# Altium project HPBIController.PrjPCB (part 8 of 8)
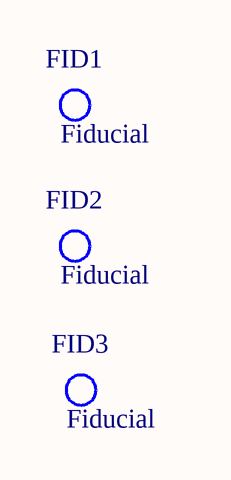
[diagram p115: BlockDiagram.SchDoc]

## Nets that join several sheets
1.0V: FPGAPower (46 pins), Power (6 pins)
1.2V: Ethernet (14 pins), Power (C244.1 C245.1 TP7.1 U6.4)
1.5V: DDR3A (37 pins), DDR3B (37 pins), FPGAPower (20 pins), Power (8 pins)
1.8V: DDR3B (C43.1 U4.2), FPGAPower (22 pins), HeaderC (J5.181 J5.182 J5.183 J5.184), Power (6 pins)
1.8VADC: Bank0-13-33 (R117.2), FPGAPower (C74.1 C75.1 L4.1 U1.K11)
3.3V: ADC (6 pins), Bank0-13-33 (9 pins), DDR3B (C41.1 R33.1 R34.1 U4.10), Ethernet (22 pins), FPGAPower (19 pins), HeaderA (J3.151 J3.153 J3.155), IOPower (6 pins), QSPIFlash (30 pins), Power (10 pins)
4.096VREF: DAC (C235.1 TP17.1 U22.10 U23.5), HeaderA (J3.112)
5V: DAC (8 pins), HeaderA (C247.1 C248.1 U24.8), HeaderC (J5.189 J5.190 J5.191 J5.192), IOPower (8 pins), Power (6 pins)
12VIN_HDR: HeaderA (J3.181 J3.182 J3.183 J3.184), HeaderB (J4.181 J4.182 J4.183 J4.184), Power (D3.1)
GND: ADC (28 pins), Bank0-13-33 (13 pins), DAC (17 pins), DDR3A (44 pins), DDR3B (57 pins), Ethernet (36 pins), FPGAPower (166 pins), HeaderA (114 pins), HeaderB (88 pins), HeaderC (84 pins), IOPower (20 pins), QSPIFlash (29 pins), Power (64 pins)
VCCO_13: FPGAPower (16 pins), HeaderA (J3.122 J3.124 J3.126), IOPower (6 pins)
VCCO_33: FPGAPower (15 pins), HeaderA (J3.128 J3.130 J3.132), IOPower (6 pins)
VCCO_34: FPGAPower (15 pins), HeaderA (J3.134 J3.136 J3.138), IOPower (6 pins)
VCCO_35: FPGAPower (16 pins), HeaderA (J3.140 J3.142 J3.144), IOPower (6 pins)
VTTREF: DDR3A (7 pins), DDR3B (5 pins)
AD00_N: Bank34-35 (U1.E16), HeaderA (J3.102)
AD00_P: Bank34-35 (U1.F16), HeaderA (J3.100)
AD01_N: Bank34-35 (U1.D15), HeaderA (J3.96)
AD01_P: Bank34-35 (U1.E15), HeaderA (J3.94)
AD02_N: Bank34-35 (U1.B15), HeaderA (J3.90)
AD02_P: Bank34-35 (U1.C15), HeaderA (J3.88)
AD03_N: Bank34-35 (U1.A17), HeaderA (J3.72)
AD03_P: Bank34-35 (U1.A16), HeaderA (J3.70)
AD04_N: Bank34-35 (U1.C20), HeaderA (J3.36)
AD04_P: Bank34-35 (U1.D20), HeaderA (J3.34)
AD05_N: Bank34-35 (U1.D21), HeaderA (J3.30)
AD05_P: Bank34-35 (U1.E21), HeaderA (J3.28)
AD06_N: Bank34-35 (U1.F19), HeaderA (J3.12)
AD06_P: Bank34-35 (U1.G19), HeaderA (J3.10)
AD07_N: Bank34-35 (U1.G21), HeaderA (J3.18)
AD07_P: Bank34-35 (U1.G20), HeaderA (J3.16)
AD08_N: Bank34-35 (U1.D17), HeaderA (J3.84)
AD08_P: Bank34-35 (U1.D16), HeaderA (J3.82)
AD09_N: Bank34-35 (U1.E18), HeaderA (J3.48)
AD09_P: Bank34-35 (U1.F18), HeaderA (J3.46)
AD10_N: Bank34-35 (U1.B17), HeaderA (J3.78)
AD10_P: Bank34-35 (U1.B16), HeaderA (J3.76)
AD11_N: Bank34-35 (U1.A19), HeaderA (J3.66)
AD11_P: Bank34-35 (U1.A18), HeaderA (J3.64)
AD12_N: Bank34-35 (U1.A22), HeaderA (J3.54)
AD12_P: Bank34-35 (U1.A21), HeaderA (J3.52)
AD13_N: Bank34-35 (U1.B22), HeaderA (J3.42)
AD13_P: Bank34-35 (U1.B21), HeaderA (J3.40)
AD14_N: Bank34-35 (U1.E20), HeaderA (J3.24)
AD14_P: Bank34-35 (U1.E19), HeaderA (J3.22)
AD15_N: Bank34-35 (U1.G22), HeaderA (J3.6)
AD15_P: Bank34-35 (U1.H22), HeaderA (J3.4)
AD16_N: Bank0-13-33 (U1.M12), HeaderA (NT1.1)
AD16_P: Bank0-13-33 (U1.L11), HeaderA (R122.2 R130.1)
ADC_EOC: ADC (U21.25), HeaderC (J5.39), QSPIFlash (JP1.1)
ADC_IN0: ADC (R83.1), HeaderA (J3.63)
ADC_IN1: ADC (R84.1), HeaderA (J3.67)
ADC_IN2: ADC (R85.1), HeaderA (J3.71)
ADC_IN3: ADC (R86.1), HeaderA (J3.75)
ADC_IN4: ADC (R88.1), HeaderA (J3.79)
ADC_IN5: ADC (R90.1), HeaderA (J3.83)
ADC_IN6: ADC (R92.1), HeaderA (J3.87)
ADC_IN7: ADC (R87.1), HeaderA (J3.91)
ADC_IN8: ADC (R89.1), HeaderA (J3.95)
ADC_IN9: ADC (R91.1), HeaderA (J3.99)
ADC_IN10: ADC (R93.1), HeaderA (J3.103)
ADC_IN11: ADC (R94.1), HeaderA (J3.107)
ADC_IN12: ADC (R95.1), HeaderA (J3.111)
ADC_IN13: ADC (R96.1), HeaderA (J3.115)
ADC_IN14: ADC (R97.1), HeaderA (J3.53)
ADC_IN15: ADC (R98.1), HeaderA (J3.57)
BANK13_IO_00: Bank0-13-33 (U1.R7), HeaderB (J4.18)
BANK13_IO_25: Bank0-13-33 (U1.U7), HeaderB (J4.40)
BANK13_LVDS01_N: Bank0-13-33 (U1.V9), HeaderB (J4.76)
BANK13_LVDS01_P: Bank0-13-33 (U1.V10), HeaderB (J4.74)
BANK13_LVDS02_N: Bank0-13-33 (U1.W8), HeaderB (J4.37)
BANK13_LVDS02_P: Bank0-13-33 (U1.V8), HeaderB (J4.39)
BANK13_LVDS03_N: Bank0-13-33 (U1.W10), HeaderB (J4.110)
BANK13_LVDS03_P: Bank0-13-33 (U1.W11), HeaderB (J4.112)
BANK13_LVDS04_N: Bank0-13-33 (U1.W12), HeaderB (J4.51)
BANK13_LVDS04_P: Bank0-13-33 (U1.V12), HeaderB (J4.49)
BANK13_LVDS05_N: Bank0-13-33 (U1.U11), HeaderB (J4.116)
BANK13_LVDS05_P: Bank0-13-33 (U1.U12), HeaderB (J4.118)
BANK13_LVDS06_N: Bank0-13-33 (U1.U9), HeaderB (J4.70)
BANK13_LVDS06_P: Bank0-13-33 (U1.U10), HeaderB (J4.68)
BANK13_LVDS07_N: Bank0-13-33 (U1.AB12), HeaderB (J4.109)
BANK13_LVDS07_P: Bank0-13-33 (U1.AA12), HeaderB (J4.111)
BANK13_LVDS08_N: Bank0-13-33 (U1.AB11), HeaderB (J4.104)
BANK13_LVDS08_P: Bank0-13-33 (U1.AA11), HeaderB (J4.106)
BANK13_LVDS09_N: Bank0-13-33 (U1.AB9), HeaderB (J4.103)
BANK13_LVDS09_P: Bank0-13-33 (U1.AB10), HeaderB (J4.105)
BANK13_LVDS10_N: Bank0-13-33 (U1.Y10), HeaderB (J4.92)
BANK13_LVDS10_P: Bank0-13-33 (U1.Y11), HeaderB (J4.94)
BANK13_LVDS11_N: Bank0-13-33 (U1.AA8), HeaderB (J4.98)
BANK13_LVDS11_P: Bank0-13-33 (U1.AA9), HeaderB (J4.100)
BANK13_LVDS12/SYSCLK1_N: Bank0-13-33 (U1.Y8), HeaderB (J4.31)
BANK13_LVDS12/SYSCLK1_P: Bank0-13-33 (U1.Y9), HeaderB (J4.33)
BANK13_LVDS13_N: Bank0-13-33 (U1.Y5), HeaderB (J4.86)
BANK13_LVDS13_P: Bank0-13-33 (U1.Y6), HeaderB (J4.88)
BANK13_LVDS14_N: Bank0-13-33 (U1.AA6), HeaderB (J4.25)
BANK13_LVDS14_P: Bank0-13-33 (U1.AA7), HeaderB (J4.27)
BANK13_LVDS15_N: Bank0-13-33 (U1.AB1), HeaderB (J4.85)
BANK13_LVDS15_P: Bank0-13-33 (U1.AB2), HeaderB (J4.87)
BANK13_LVDS16_N: Bank0-13-33 (U1.AB4), HeaderB (J4.91)
BANK13_LVDS16_P: Bank0-13-33 (U1.AB5), HeaderB (J4.93)
BANK13_LVDS17_N: Bank0-13-33 (U1.AB6), HeaderB (J4.97)
BANK13_LVDS17_P: Bank0-13-33 (U1.AB7), HeaderB (J4.99)
BANK13_LVDS18_N: Bank0-13-33 (U1.AA4), HeaderB (J4.52)
BANK13_LVDS18_P: Bank0-13-33 (U1.Y4), HeaderB (J4.50)
BANK13_LVDS19_N: Bank0-13-33 (U1.T6), HeaderB (J4.24)
BANK13_LVDS19_P: Bank0-13-33 (U1.R6), HeaderB (J4.22)
BANK13_LVDS20_N: Bank0-13-33 (U1.U4), HeaderB (J4.36)
BANK13_LVDS20_P: Bank0-13-33 (U1.T4), HeaderB (J4.34)
BANK13_LVDS21_N: Bank0-13-33 (U1.V4), HeaderB (J4.46)
BANK13_LVDS21_P: Bank0-13-33 (U1.V5), HeaderB (J4.44)
BANK13_LVDS22_N: Bank0-13-33 (U1.U5), HeaderB (J4.30)
BANK13_LVDS22_P: Bank0-13-33 (U1.U6), HeaderB (J4.28)
BANK13_LVDS23_N: Bank0-13-33 (U1.W7), HeaderB (J4.82)
BANK13_LVDS23_P: Bank0-13-33 (U1.V7), HeaderB (J4.80)
BANK13_LVDS24_N: Bank0-13-33 (U1.W5), HeaderB (J4.58)
BANK13_LVDS24_P: Bank0-13-33 (U1.W6), HeaderB (J4.56)
BANK33_IO_00: Bank0-13-33 (U1.U19), HeaderB (J4.177)
BANK33_IO_25: Bank0-13-33 (U1.U14), HeaderB (J4.160)
BANK33_LVDS01_N: Bank0-13-33 (U1.U21), HeaderB (J4.176)
BANK33_LVDS01_P: Bank0-13-33 (U1.T21), HeaderB (J4.178)
BANK33_LVDS02_N: Bank0-13-33 (U1.U22), HeaderB (J4.170)
BANK33_LVDS02_P: Bank0-13-33 (U1.T22), HeaderB (J4.172)
BANK33_LVDS03_N: Bank0-13-33 (U1.W22), HeaderB (J4.164)
BANK33_LVDS03_P: Bank0-13-33 (U1.V22), HeaderB (J4.166)
BANK33_LVDS04_N: Bank0-13-33 (U1.W21), HeaderB (J4.161)
BANK33_LVDS04_P: Bank0-13-33 (U1.W20), HeaderB (J4.159)
BANK33_LVDS05_N: Bank0-13-33 (U1.V20), HeaderB (J4.150)
BANK33_LVDS05_P: Bank0-13-33 (U1.U20), HeaderB (J4.148)
BANK33_LVDS06_N: Bank0-13-33 (U1.V19), HeaderB (J4.144)
BANK33_LVDS06_P: Bank0-13-33 (U1.V18), HeaderB (J4.142)
BANK33_LVDS07_N: Bank0-13-33 (U1.AB22), HeaderB (J4.173)
BANK33_LVDS07_P: Bank0-13-33 (U1.AA22), HeaderB (J4.171)
BANK33_LVDS08_N: Bank0-13-33 (U1.AB21), HeaderB (J4.167)
BANK33_LVDS08_P: Bank0-13-33 (U1.AA21), HeaderB (J4.165)
BANK33_LVDS09_N: Bank0-13-33 (U1.Y21), HeaderB (J4.156)
BANK33_LVDS09_P: Bank0-13-33 (U1.Y20), HeaderB (J4.154)
BANK33_LVDS10_N: Bank0-13-33 (U1.AB20), HeaderB (J4.149)
BANK33_LVDS10_P: Bank0-13-33 (U1.AB19), HeaderB (J4.147)
BANK33_LVDS11_N: Bank0-13-33 (U1.AA19), HeaderB (J4.143)
BANK33_LVDS11_P: Bank0-13-33 (U1.Y19), HeaderB (J4.141)
BANK33_LVDS12/SYSCLK2_N: Bank0-13-33 (U1.AA18), HeaderB (J4.137)
BANK33_LVDS12/SYSCLK2_P: Bank0-13-33 (U1.Y18), HeaderB (J4.135)
BANK33_LVDS13_N: Bank0-13-33 (U1.W18), HeaderB (J4.81)
BANK33_LVDS13_P: Bank0-13-33 (U1.W17), HeaderB (J4.79)
BANK33_LVDS14_N: Bank0-13-33 (U1.Y16), HeaderB (J4.138)
BANK33_LVDS14_P: Bank0-13-33 (U1.W16), HeaderB (J4.136)
BANK33_LVDS15_N: Bank0-13-33 (U1.U16), HeaderB (J4.155)
BANK33_LVDS15_P: Bank0-13-33 (U1.U15), HeaderB (J4.153)
BANK33_LVDS16_N: Bank0-13-33 (U1.V17), HeaderB (J4.132)
BANK33_LVDS16_P: Bank0-13-33 (U1.U17), HeaderB (J4.130)
BANK33_LVDS17_N: Bank0-13-33 (U1.AB17), HeaderB (J4.131)
BANK33_LVDS17_P: Bank0-13-33 (U1.AA17), HeaderB (J4.129)
BANK33_LVDS18_N: Bank0-13-33 (U1.AB16), HeaderB (J4.125)
BANK33_LVDS18_P: Bank0-13-33 (U1.AA16), HeaderB (J4.123)
BANK33_LVDS19_N: Bank0-13-33 (U1.V15), HeaderB (J4.45)
BANK33_LVDS19_P: Bank0-13-33 (U1.V14), HeaderB (J4.43)
BANK33_LVDS20_N: Bank0-13-33 (U1.W13), HeaderB (J4.57)
BANK33_LVDS20_P: Bank0-13-33 (U1.V13), HeaderB (J4.55)
BANK33_LVDS21_N: Bank0-13-33 (U1.Y15), HeaderB (J4.75)
BANK33_LVDS21_P: Bank0-13-33 (U1.W15), HeaderB (J4.73)
BANK33_LVDS22_N: Bank0-13-33 (U1.AA14), HeaderB (J4.69)
BANK33_LVDS22_P: Bank0-13-33 (U1.Y14), HeaderB (J4.67)
BANK33_LVDS23_N: Bank0-13-33 (U1.AA13), HeaderB (J4.126)
BANK33_LVDS23_P: Bank0-13-33 (U1.Y13), HeaderB (J4.124)
BANK33_LVDS24_N: Bank0-13-33 (U1.AB15), HeaderB (J4.115)
BANK33_LVDS24_P: Bank0-13-33 (U1.AB14), HeaderB (J4.117)
BANK34_IO_00: Bank34-35 (U1.H15), HeaderC (J5.88)
BANK34_IO_25: Bank34-35 (U1.R15), HeaderC (J5.105)
BANK34_LVDS01_N: Bank34-35 (U1.K15), HeaderC (J5.84)
BANK34_LVDS01_P: Bank34-35 (U1.J15), HeaderC (J5.82)
BANK34_LVDS02_N: Bank34-35 (U1.J17), HeaderC (J5.100)
BANK34_LVDS02_P: Bank34-35 (U1.J16), HeaderC (J5.98)
BANK34_LVDS03_N: Bank34-35 (U1.L16), HeaderC (J5.127)
BANK34_LVDS03_P/PUDC: Bank34-35 (U1.K16), HeaderC (J5.125)
BANK34_LVDS04_N: Bank34-35 (U1.M17), HeaderC (J5.166)
BANK34_LVDS04_P: Bank34-35 (U1.L17), HeaderC (J5.164)
BANK34_LVDS05_N: Bank34-35 (U1.N18), HeaderC (J5.77)
BANK34_LVDS05_P: Bank34-35 (U1.N17), HeaderC (J5.75)
BANK34_LVDS06_N: Bank34-35 (U1.M16), HeaderC (J5.117)
BANK34_LVDS06_P: Bank34-35 (U1.M15), HeaderC (J5.115)
BANK34_LVDS07_N: Bank34-35 (U1.K18), HeaderC (J5.112)
BANK34_LVDS07_P: Bank34-35 (U1.J18), HeaderC (J5.110)
BANK34_LVDS08_N: Bank34-35 (U1.J22), HeaderC (J5.126)
BANK34_LVDS08_P: Bank34-35 (U1.J21), HeaderC (J5.124)
BANK34_LVDS09_N: Bank34-35 (U1.K21), HeaderC (J5.165)
BANK34_LVDS09_P: Bank34-35 (U1.J20), HeaderC (J5.163)
BANK34_LVDS10_N: Bank34-35 (U1.L22), HeaderC (J5.132)
BANK34_LVDS10_P: Bank34-35 (U1.L21), HeaderC (J5.130)
BANK34_LVDS11_N: Bank34-35 (U1.K20), HeaderC (J5.118)
BANK34_LVDS11_P: Bank34-35 (U1.K19), HeaderC (J5.116)
BANK34_LVDS12/SYSCLK3_N: Bank34-35 (U1.L19), HeaderC (J5.138)
BANK34_LVDS12/SYSCLK3_P: Bank34-35 (U1.L18), HeaderC (J5.136)
BANK34_LVDS13_N: Bank34-35 (U1.M20), HeaderC (J5.144)
BANK34_LVDS13_P: Bank34-35 (U1.M19), HeaderC (J5.142)
BANK34_LVDS14_N: Bank34-35 (U1.N20), HeaderC (J5.83)
BANK34_LVDS14_P: Bank34-35 (U1.N19), HeaderC (J5.81)
BANK34_LVDS15_N: Bank34-35 (U1.M22), HeaderC (J5.95)
BANK34_LVDS15_P: Bank34-35 (U1.M21), HeaderC (J5.93)
BANK34_LVDS16_N: Bank34-35 (U1.P22), HeaderC (J5.150)
BANK34_LVDS16_P: Bank34-35 (U1.N22), HeaderC (J5.148)
BANK34_LVDS17_N: Bank34-35 (U1.R21), HeaderC (J5.178)
BANK34_LVDS17_P: Bank34-35 (U1.R20), HeaderC (J5.176)
BANK34_LVDS18_N: Bank34-35 (U1.P21), HeaderC (J5.89)
BANK34_LVDS18_P: Bank34-35 (U1.P20), HeaderC (J5.87)
BANK34_LVDS19_N: Bank34-35 (U1.P15), HeaderC (J5.111)
BANK34_LVDS19_P: Bank34-35 (U1.N15), HeaderC (J5.109)
BANK34_LVDS20_N: Bank34-35 (U1.P18), HeaderC (J5.71)
BANK34_LVDS20_P: Bank34-35 (U1.P17), HeaderC (J5.69)
BANK34_LVDS21_N: Bank34-35 (U1.T17), HeaderC (J5.101)
BANK34_LVDS21_P: Bank34-35 (U1.T16), HeaderC (J5.99)
BANK34_LVDS22_N: Bank34-35 (U1.T19), HeaderC (J5.172)
BANK34_LVDS22_P: Bank34-35 (U1.R19), HeaderC (J5.170)
BANK34_LVDS23_N: Bank34-35 (U1.T18), HeaderC (J5.156)
BANK34_LVDS23_P: Bank34-35 (U1.R18), HeaderC (J5.154)
BANK34_LVDS24_N: Bank34-35 (U1.R16), HeaderC (J5.78)
BANK34_LVDS24_P: Bank34-35 (U1.P16), HeaderC (J5.76)
BANK35_IO_00: Bank34-35 (U1.H17), HeaderC (J5.131)
BANK35_IO_25: Bank34-35 (U1.H18), HeaderC (J5.135)
BANK35_LVDS04_N: Bank34-35 (U1.G16), HeaderC (J5.94)
BANK35_LVDS04_P: Bank34-35 (U1.G15), HeaderC (J5.92)
BANK35_LVDS06_N/VREF: Bank34-35 (U1.F17), HeaderC (J5.141)
BANK35_LVDS06_P: Bank34-35 (U1.G17), HeaderC (J5.139)
BANK35_LVDS11_N: Bank34-35 (U1.C18), HeaderC (J5.153)
BANK35_LVDS11_P: Bank34-35 (U1.C17), HeaderC (J5.151)
BANK35_LVDS12/SYSCLK0_N: Bank34-35 (U1.C19), HeaderC (J5.106)
BANK35_LVDS12/SYSCLK0_P: Bank34-35 (U1.D18), HeaderC (J5.104)
BANK35_LVDS13_N: Bank34-35 (U1.B20), HeaderC (J5.159)
BANK35_LVDS13_P: Bank34-35 (U1.B19), HeaderC (J5.157)
BANK35_LVDS16_N: Bank34-35 (U1.C22), HeaderC (J5.171)
BANK35_LVDS16_P: Bank34-35 (U1.D22), HeaderC (J5.169)
BANK35_LVDS19_N/VREF: Bank34-35 (U1.H20), HeaderC (J5.147)
BANK35_LVDS19_P: Bank34-35 (U1.H19), HeaderC (J5.145)
BANK35_LVDS23_N: Bank34-35 (U1.F22), HeaderC (J5.177)
BANK35_LVDS23_P: Bank34-35 (U1.F21), HeaderC (J5.175)
CARRIER_SRST_B: HeaderC (J5.3), QSPIFlash (R67.1 U12.3)
CONSOLE_UART_RX: HeaderC (J5.52), QSPIFlash (U1.D11)
CONSOLE_UART_TX: HeaderC (J5.56), QSPIFlash (U1.C14)
DAC_LD: DAC (U22.15), HeaderC (J5.35), QSPIFlash (U1.B6)
DAC_OUT1: DAC (C224.1 TP36.1 U22.18), HeaderA (J3.3 U24.2)
DAC_OUT2: DAC (C225.1 TP37.1 U22.19), HeaderA (J3.7 U24.5)
DAC_OUT3: DAC (C226.1 TP38.1 U22.2), HeaderA (J3.11)
DAC_OUT4: DAC (C227.1 TP39.1 U22.3), HeaderA (J3.15)
DAC_OUT5: DAC (C228.1 TP40.1 U22.4), HeaderA (J3.19)
DAC_OUT6: DAC (C229.1 TP41.1 U22.7), HeaderA (J3.23)
DAC_OUT7: DAC (C230.1 TP42.1 U22.8), HeaderA (J3.27)
DAC_OUT8: DAC (C231.1 TP43.1 U22.9), HeaderA (J3.31)
DAC_OUT9: DAC (C232.1 TP44.1 U22.12), HeaderA (J3.35)
DAC_OUT10: DAC (C233.1 TP45.1 U22.13), HeaderA (J3.39)
DDR3_A0: DDR3A (U1.M4 U2.N3), DDR3B (R22.2 U3.N3)
DDR3_A1: DDR3A (U1.M5 U2.P7), DDR3B (R21.2 U3.P7)
DDR3_A2: DDR3A (U1.K4 U2.P3), DDR3B (R20.2 U3.P3)
DDR3_A3: DDR3A (U1.L4 U2.N2), DDR3B (R19.2 U3.N2)
DDR3_A4: DDR3A (U1.K6 U2.P8), DDR3B (R18.2 U3.P8)
DDR3_A5: DDR3A (U1.K5 U2.P2), DDR3B (R17.2 U3.P2)
DDR3_A6: DDR3A (U1.J7 U2.R8), DDR3B (R16.2 U3.R8)
DDR3_A7: DDR3A (U1.J6 U2.R2), DDR3B (R15.2 U3.R2)
DDR3_A8: DDR3A (U1.J5 U2.T8), DDR3B (R14.2 U3.T8)
DDR3_A9: DDR3A (U1.H5 U2.R3), DDR3B (R13.2 U3.R3)
DDR3_A10: DDR3A (U1.J3 U2.L7), DDR3B (R12.2 U3.L7)
DDR3_A11: DDR3A (U1.G5 U2.R7), DDR3B (R11.2 U3.R7)
DDR3_A12: DDR3A (U1.H4 U2.N7), DDR3B (R10.2 U3.N7)
DDR3_A13: DDR3A (U1.F4 U2.T3), DDR3B (R9.2 U3.T3)
DDR3_A14: DDR3A (U1.G4 U2.T7), DDR3B (R8.2 U3.T7)
DDR3_BA0: DDR3A (U1.L7 U2.M2), DDR3B (R23.2 U3.M2)
DDR3_BA1: DDR3A (U1.L6 U2.N8), DDR3B (R24.2 U3.N8)
DDR3_BA2: DDR3A (U1.M6 U2.M3), DDR3B (R25.2 U3.M3)
DDR3_CAS_B: DDR3A (U1.P3 U2.K3), DDR3B (R28.2 U3.K3)
DDR3_CK0_N: DDR3A (U1.N5 U2.K7), DDR3B (R32.1 U3.K7)
DDR3_CK0_P: DDR3A (U1.N4 U2.J7), DDR3B (R32.2 U3.J7)
DDR3_CKE: DDR3A (U1.V3 U2.K9), DDR3B (R35.2 U3.K9)
DDR3_CS_B: DDR3A (U1.P6 U2.L2), DDR3B (R26.2 U3.L2)
DDR3_DM2: DDR3A (U1.P1), DDR3B (U3.E7)
DDR3_DM3: DDR3A (U1.AA2), DDR3B (U3.D3)
DDR3_DQ16: DDR3A (U1.M1), DDR3B (U3.E3)
DDR3_DQ17: DDR3A (U1.R1), DDR3B (U3.F7)
DDR3_DQ18: DDR3A (U1.M2), DDR3B (U3.F2)
DDR3_DQ19: DDR3A (U1.N3), DDR3B (U3.F8)
DDR3_DQ20: DDR3A (U1.R3), DDR3B (U3.H3)
DDR3_DQ21: DDR3A (U1.T2), DDR3B (U3.H8)
DDR3_DQ22: DDR3A (U1.T1), DDR3B (U3.G2)
DDR3_DQ23: DDR3A (U1.T3), DDR3B (U3.H7)
DDR3_DQ24: DDR3A (U1.U1), DDR3B (U3.D7)
DDR3_DQ25: DDR3A (U1.AA1), DDR3B (U3.C3)
DDR3_DQ26: DDR3A (U1.AA3), DDR3B (U3.C8)
DDR3_DQ27: DDR3A (U1.W1), DDR3B (U3.C2)
DDR3_DQ28: DDR3A (U1.Y3), DDR3B (U3.A7)
DDR3_DQ29: DDR3A (U1.Y1), DDR3B (U3.A2)
DDR3_DQ30: DDR3A (U1.U2), DDR3B (U3.B8)
DDR3_DQ31: DDR3A (U1.W3), DDR3B (U3.A3)
DDR3_DQS2_N: DDR3A (U1.P2), DDR3B (U3.G3)
DDR3_DQS2_P: DDR3A (U1.N2), DDR3B (U3.F3)
DDR3_DQS3_N: DDR3A (U1.W2), DDR3B (U3.B7)
DDR3_DQS3_P: DDR3A (U1.V2), DDR3B (U3.C7)
DDR3_ODT: DDR3A (U1.P5 U2.K1), DDR3B (R30.2 U3.K1)
DDR3_RAS_B: DDR3A (U1.R5 U2.J3), DDR3B (R29.2 U3.J3)
DDR3_RESET_B: DDR3A (U1.F3 U2.T2), DDR3B (R31.1 U3.T2)
DDR3_WE_B: DDR3A (U1.R4 U2.L3), DDR3B (R27.2 U3.L3)
DEV_ID0: HeaderC (J5.7), QSPIFlash (R125.1 U1.D5)
DEV_ID1: HeaderC (J5.11), QSPIFlash (R126.1 U1.E5)
DUT_PRESENT_N: HeaderC (J5.19), QSPIFlash (R128.2 U1.G7)
ETH_MDC: Ethernet (R44.1 U5.36), QSPIFlash (U1.D10)
ETH_MDIO: Ethernet (R39.1 U5.37), QSPIFlash (U1.C12)
ETH_RX_CLK: Ethernet (R101.1 R112.2), QSPIFlash (U1.A14)
ETH_RX_CTRL: Ethernet (R102.1 R111.2), QSPIFlash (U1.D7)
ETH_RXD0: Ethernet (R103.1 R110.2), QSPIFlash (U1.E11)
ETH_RXD1: Ethernet (R104.1 R109.2), QSPIFlash (U1.B7)
ETH_RXD2: Ethernet (R105.1 R108.2), QSPIFlash (U1.F12)
ETH_RXD3: Ethernet (R106.1 R107.2), QSPIFlash (U1.A13)
ETH_TX_CLK: Ethernet (U5.24), QSPIFlash (U1.D6)
ETH_TX_CTRL: Ethernet (U5.25), QSPIFlash (U1.F11)
ETH_TXD0: Ethernet (U5.19), QSPIFlash (U1.E9)
ETH_TXD1: Ethernet (U5.20), QSPIFlash (U1.A7)
ETH_TXD2: Ethernet (U5.21), QSPIFlash (U1.E10)
ETH_TXD3: Ethernet (U5.22), QSPIFlash (U1.A8)
FPGA_DONE: Bank0-13-33 (D2.1 R4.1 U1.T12), HeaderC (J5.4)
I2C0_SCL: HeaderC (J5.64), IOPower (U17.24), QSPIFlash (R45.2 U1.D13)
I2C0_SDA: HeaderC (J5.68), IOPower (U17.27), QSPIFlash (R78.2 U1.C10)
I2C1_SCL/MIO12: HeaderC (J5.23), QSPIFlash (R114.2 U1.C5)
I2C1_SDA/MIO13: HeaderC (J5.27), QSPIFlash (R115.2 U1.A6)
INIT_B: Bank0-13-33 (R1.1 U1.T14), HeaderC (J5.8)
JTAG_RST_B: Bank0-13-33 (J1.14), QSPIFlash (R66.1 U12.1)
MIO15: HeaderC (J5.31), QSPIFlash (JP1.3)
MIO47: HeaderC (J5.43), QSPIFlash (U1.B10)
PG_1V8: HeaderC (J5.16), Power (R60.1 R62.1 U8.13 U10.4)
PHY_RESET_B_AND: Ethernet (U25.2), QSPIFlash (U1.B4)
POWER_GOOD: Ethernet (U25.1), QSPIFlash (U1.B5), Power (R53.1 R57.1 U9.4)
PWR_ENABLE: HeaderC (J5.12), Power (R46.1 U7.13)
SMBUS_ALERT_N: HeaderC (J5.15), QSPIFlash (U1.C4)
SPI0_MISO_SLAVE0: DAC (U22.14), QSPIFlash (U29.2)
SPI0_MISO_SLAVE1: ADC (U21.24), QSPIFlash (NT34.1)
SPI0_MISO_SLAVE2: HeaderC (J5.51), QSPIFlash (U30.2)
SPI0_MOSI: ADC (U21.21), DAC (U22.17), HeaderC (J5.47), QSPIFlash (U1.G13)
SPI0_SCLK: ADC (U21.19), DAC (U22.16), HeaderC (J5.55), QSPIFlash (U1.A12)
SPI0_SS1: ADC (U21.20), QSPIFlash (U1.F9)
SPI0_SS2: HeaderC (J5.59), QSPIFlash (U1.C7 U30.1)
SPI1_MISO_SLAVE0: HeaderC (J5.24), QSPIFlash (U26.2)
SPI1_MISO_SLAVE1: HeaderC (J5.28), QSPIFlash (U27.2)
SPI1_MISO_SLAVE2: HeaderC (J5.32), QSPIFlash (U28.2)
SPI1_MOSI: HeaderC (J5.20), QSPIFlash (U1.B12)
SPI1_SCLK: HeaderC (J5.36), QSPIFlash (U1.A9)
SPI1_SS0: HeaderC (J5.40), QSPIFlash (U1.B14 U26.1)
SPI1_SS1: HeaderC (J5.44), QSPIFlash (U1.F13 U27.1)
SPI1_SS2: HeaderC (J5.48), QSPIFlash (U1.C13 U28.1)
STATUS_LED: HeaderC (J5.72), QSPIFlash (U1.G6)

## Assembly variants
Standard: not fitted C103 C104 Q1 R118